# EAGLE schematic de0 (EAGLE 9.6.2)
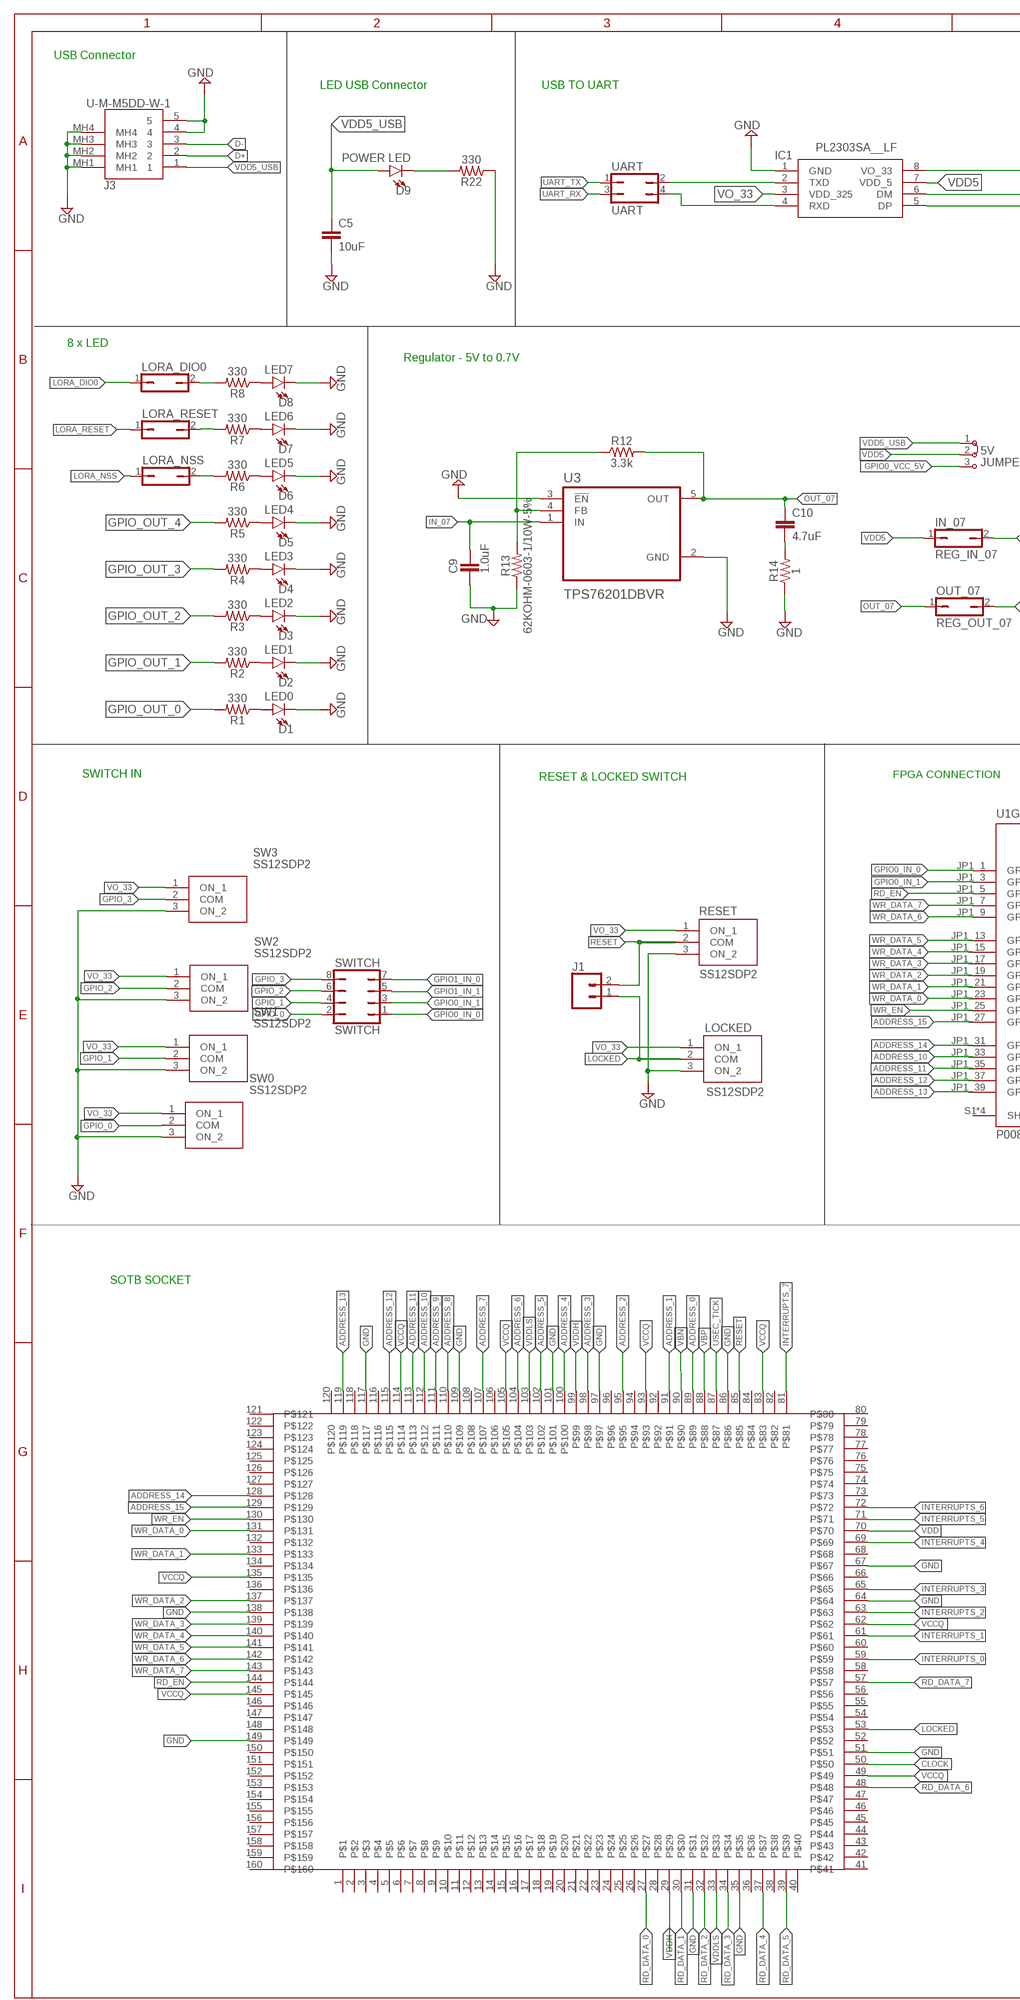
[diagram p0: schematic, sheet 1, part 1 of 2]
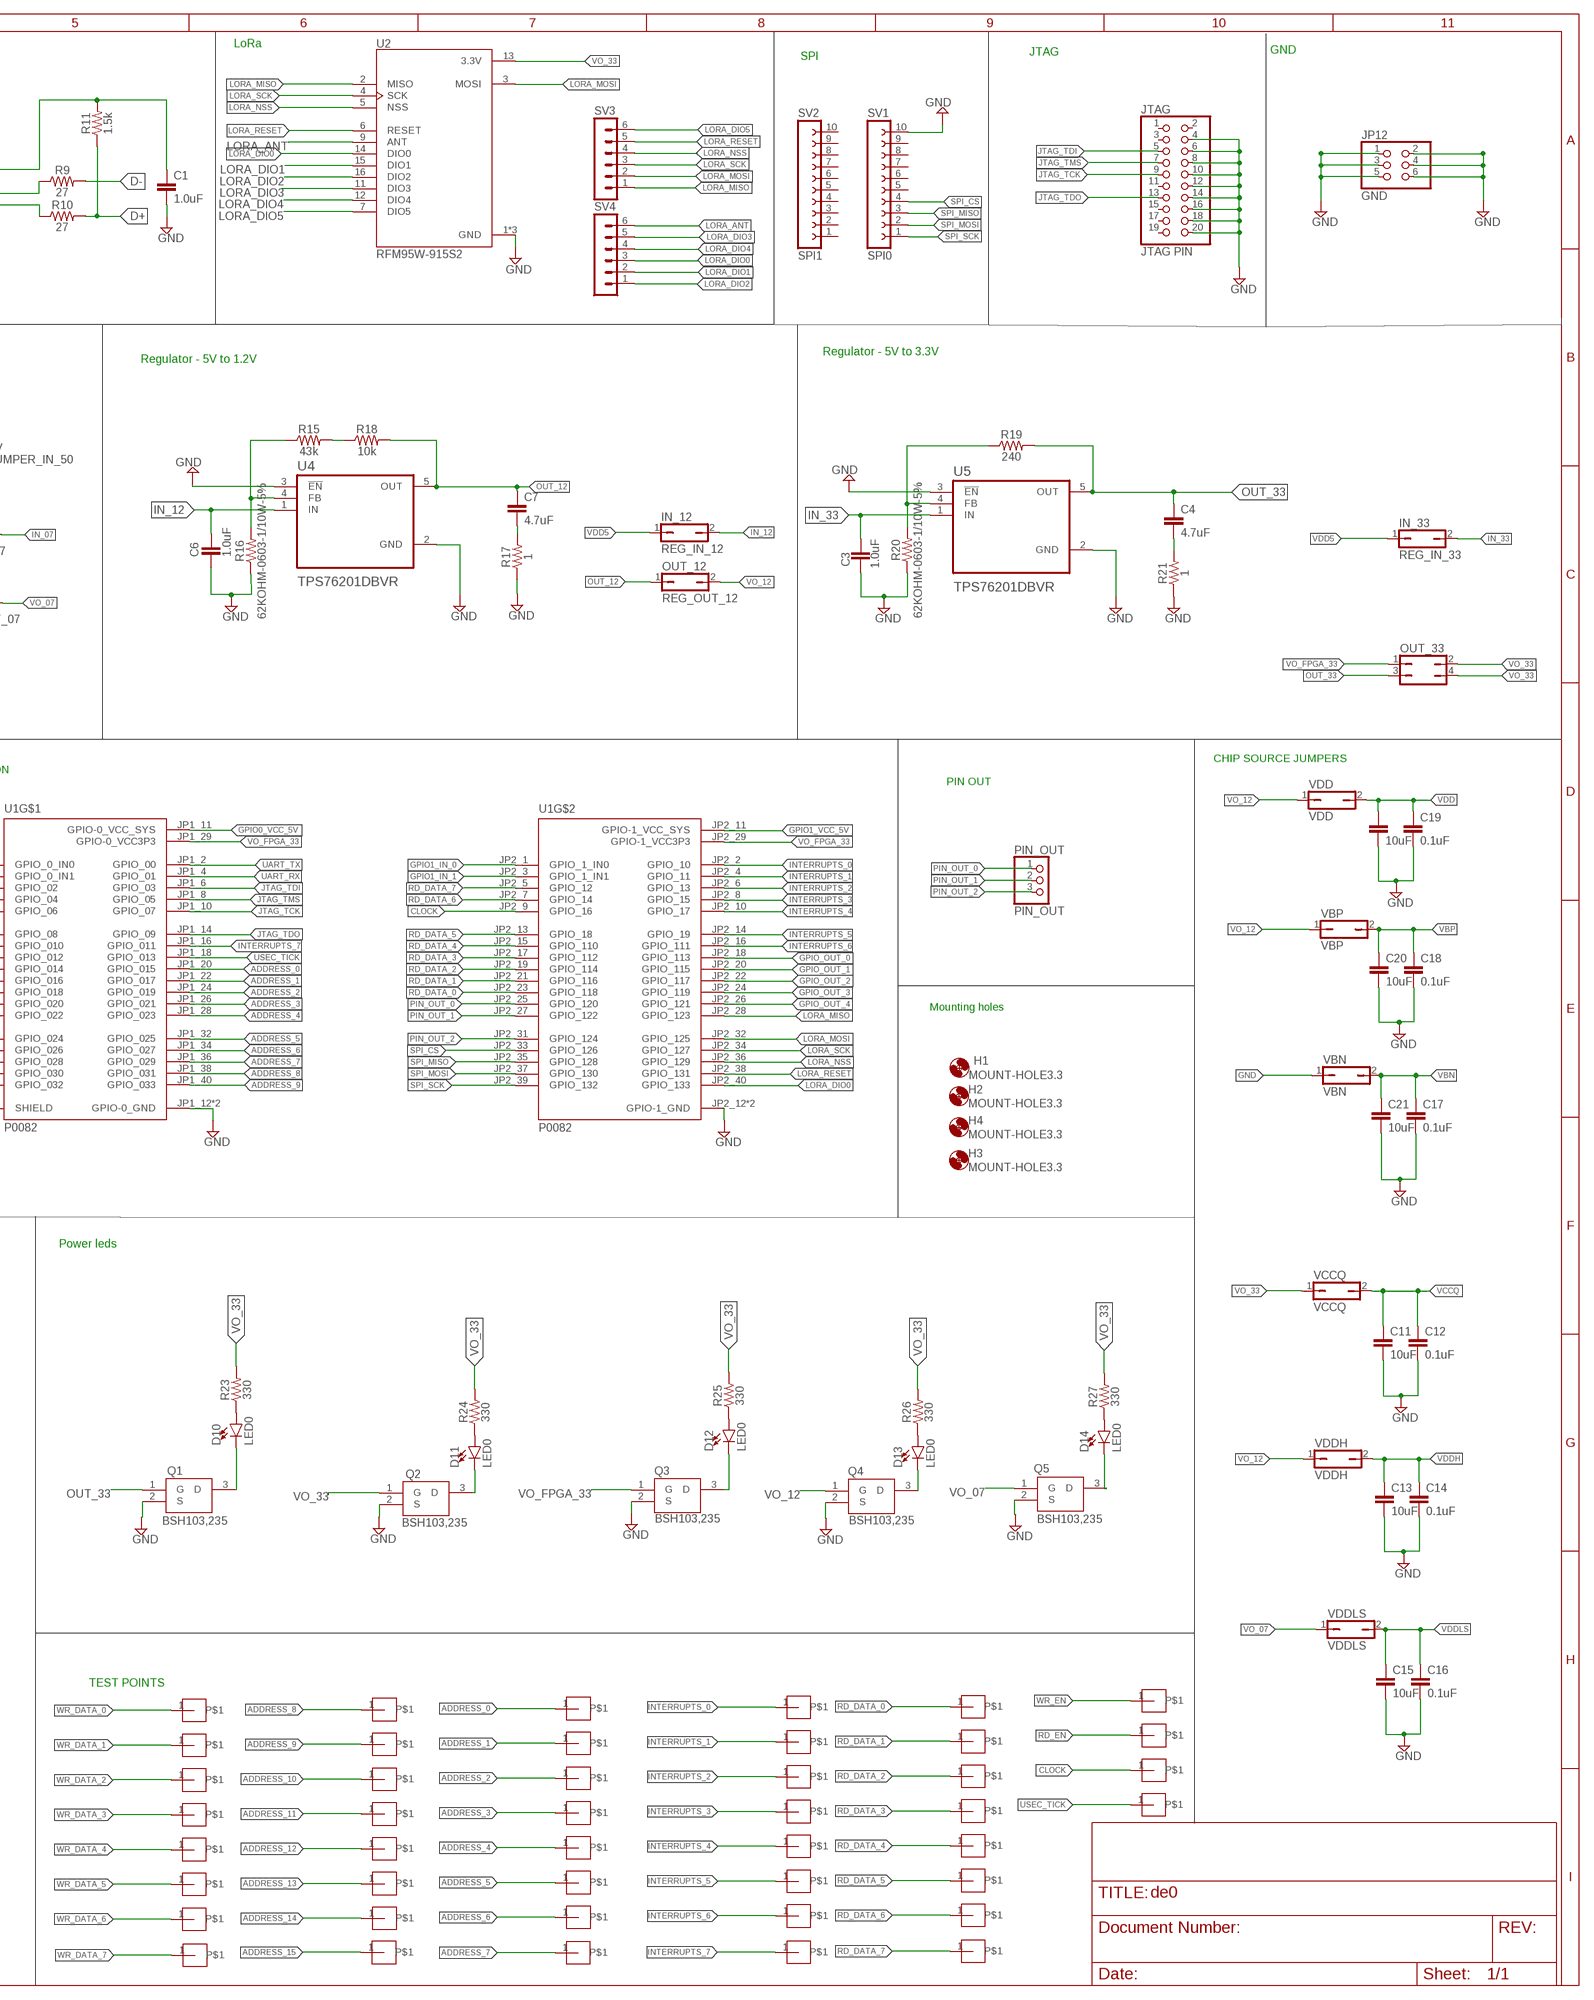
[diagram p1: schematic, sheet 1, part 2 of 2]

## Parts
5V  JUMPER_IN_50  J2X2MM  [04C]
ADDRESS_0  POINT  [POINT]
ADDRESS_1  POINT  [POINT]
ADDRESS_2  POINT  [POINT]
ADDRESS_3  POINT  [POINT]
ADDRESS_4  POINT  [POINT]
ADDRESS_5  POINT  [POINT]
ADDRESS_6  POINT  [POINT]
ADDRESS_7  POINT  [POINT]
ADDRESS_8  POINT  [POINT]
ADDRESS_9  POINT  [POINT]
ADDRESS_10  POINT  [POINT]
ADDRESS_11  POINT  [POINT]
ADDRESS_12  POINT  [POINT]
ADDRESS_13  POINT  [POINT]
ADDRESS_14  POINT  [POINT]
ADDRESS_15  POINT  [POINT]
C1  1.0uF  1.0UF-0603-16V-10%  [0603]
C3  1.0uF  1.0UF-0603-16V-10%  [0603]
C4  4.7uF  4.7UF0603  [0603]
C5  10uF  10UF-0603-6.3V-20%  [0603]
C6  1.0uF  1.0UF-0603-16V-10%  [0603]
C7  4.7uF  4.7UF0603  [0603]
C9  1.0uF  1.0UF-0603-16V-10%  [0603]
C10  4.7uF  4.7UF0603  [0603]
C11  10uF  10UF-0603-6.3V-20%  [0603]
C12  0.1uF  0.1UF-0603-25V-(+80/-20%)  [0603]
C13  10uF  10UF-0603-6.3V-20%  [0603]
C14  0.1uF  0.1UF-0603-25V-(+80/-20%)  [0603]
C15  10uF  10UF-0603-6.3V-20%  [0603]
C16  0.1uF  0.1UF-0603-25V-(+80/-20%)  [0603]
C17  0.1uF  0.1UF-0603-25V-(+80/-20%)  [0603]
C18  0.1uF  0.1UF-0603-25V-(+80/-20%)  [0603]
C19  0.1uF  0.1UF-0603-25V-(+80/-20%)  [0603]
C20  10uF  10UF-0603-6.3V-20%  [0603]
C21  10uF  10UF-0603-6.3V-20%  [0603]
C22  10uF  10UF-0603-6.3V-20%  [0603]
CLOCK  POINT  [POINT]
D1  LED0  LED0603  [LED-0603]
D2  LED1  LED0603  [LED-0603]
D3  LED2  LED0603  [LED-0603]
D4  LED3  LED0603  [LED-0603]
D5  LED4  LED0603  [LED-0603]
D6  LED5  LED0603  [LED-0603]
D7  LED6  LED0603  [LED-0603]
D8  LED7  LED0603  [LED-0603]
D9  POWER LED  LED0603  [LED-0603]
D10  LED0  LED0603  [LED-0603]
D11  LED0  LED0603  [LED-0603]
D12  LED0  LED0603  [LED-0603]
D13  LED0  LED0603  [LED-0603]
D14  LED0  LED0603  [LED-0603]
H1  MOUNT-HOLE3.3  [3,3]
H2  MOUNT-HOLE3.3  [3,3]
H3  MOUNT-HOLE3.3  [3,3]
H4  MOUNT-HOLE3.3  [3,3]
IC1  PL2303SA__LF  [SOIC127P600X170-8N]
IN_07  REG_IN_07  JP1Q  [JP1]
IN_12  REG_IN_12  JP1Q  [JP1]
IN_33  REG_IN_33  JP1Q  [JP1]
INTERRUPTS_6  INTERRUPTS_6  POINT  [POINT]
J1  CONN_02  [1X02]
J3  U-M-M5DD-W-1  [UMM5DDW1]
JP12  GND  PINHD-2X3  [2X03]
JTAG  JTAG PIN  PINHD-2X10  [2X10]
LOCKED  SS12SDP2  [SS12SDP2]
LORA_DIO0  JP1Q  [JP1]
LORA_NSS  JP1Q  [JP1]
LORA_RESET  JP1Q  [JP1]
OUT_07  REG_OUT_07  JP1Q  [JP1]
OUT_12  REG_OUT_12  JP1Q  [JP1]
OUT_33  JP2Q  [JP2Q]
PIN_OUT  PIN_OUT  PINHD-1X3  [1X03]
Q1  BSH103,235  [SOT95P230X110-3N]
Q2  BSH103,235  [SOT95P230X110-3N]
Q3  BSH103,235  [SOT95P230X110-3N]
Q4  BSH103,235  [SOT95P230X110-3N]
Q5  BSH103,235  [SOT95P230X110-3N]
R1  330  330OHM-0603-1/10W-1%  [0603]
R2  330  330OHM-0603-1/10W-1%  [0603]
R3  330  330OHM-0603-1/10W-1%  [0603]
R4  330  330OHM-0603-1/10W-1%  [0603]
R5  330  330OHM-0603-1/10W-1%  [0603]
R6  330  330OHM-0603-1/10W-1%  [0603]
R7  330  330OHM-0603-1/10W-1%  [0603]
R8  330  330OHM-0603-1/10W-1%  [0603]
R9  27  27OHM-0603-1/10W-1%  [0603]
R10  27  27OHM-0603-1/10W-1%  [0603]
R11  1.5k  1.5KOHM-0603-1/10W-1%  [0603]
R12  3.3k  3.3KOHM-0603-1/10W-1%  [0603]
R13  62KOHM-0603-1/10W-5%  [0603]
R14  1  1OHM-0603-1/10W-1%  [0603]
R15  43k  43KOHM-0603-1/10W-1%  [0603]
R16  62KOHM-0603-1/10W-5%  [0603]
R17  1  1OHM-0603-1/10W-1%  [0603]
R18  10k  10KOHM-0603-1/10W-1%  [0603]
R19  240  240OHM-0603-1/10W-1%  [0603]
R20  62KOHM-0603-1/10W-5%  [0603]
R21  1  1OHM-0603-1/10W-1%  [0603]
R22  330  330OHM-0603-1/10W-1%  [0603]
R23  330  330OHM-0603-1/10W-1%  [0603]
R24  330  330OHM-0603-1/10W-1%  [0603]
R25  330  330OHM-0603-1/10W-1%  [0603]
R26  330  330OHM-0603-1/10W-1%  [0603]
R27  330  330OHM-0603-1/10W-1%  [0603]
RD_DATA_0  POINT  [POINT]
RD_DATA_2  POINT  [POINT]
RD_DATA_3  POINT  [POINT]
RD_DATA_4  POINT  [POINT]
RD_DATA_5  POINT  [POINT]
RD_DATA_6  POINT  [POINT]
RD_DATA_7  POINT  [POINT]
RD_EN  POINT  [POINT]
RESET  SS12SDP2  [SS12SDP2]
SV1  SPI0  FE10-1  [FE10]
SV2  SPI1  FE10-1  [FE10]
SV3  MA06-1  [MA06-1]
SV4  MA06-1  [MA06-1]
SW0  SS12SDP2  [SS12SDP2]
SW1  SS12SDP2  [SS12SDP2]
SW2  SS12SDP2  [SS12SDP2]
SW3  SS12SDP2  [SS12SDP2]
SWITCH  SWITCH  JP4Q  [JP4Q]
U1  P0082  [MODULE_P0082_BOTTOMMOUNT]
U2  RFM95W-915S2  [XCVR_RFM95W-915S2]
U3  TPS76201DBVR  [SOT95P280X145-5N]
U4  TPS76201DBVR  [SOT95P280X145-5N]
U5  TPS76201DBVR  [SOT95P280X145-5N]
U$1  SOCKET  QFP160_SOCKET  [QFP160_SOCKET]
U$4  POINT  [POINT]
U$10  INTERRUPTS_0  POINT  [POINT]
U$11  INTERRUPTS_1  POINT  [POINT]
U$12  INTERRUPTS_2  POINT  [POINT]
U$13  INTERRUPTS_3  POINT  [POINT]
U$14  INTERRUPTS_5  POINT  [POINT]
U$15  INTERRUPTS_5  POINT  [POINT]
U$17  INTERRUPTS_7  POINT  [POINT]
U$40  POINT  [POINT]
UART  UART  JP2Q  [JP2Q]
USEC_TICK  POINT  [POINT]
VBN  VBN  JP1Q  [JP1]
VBP  VBP  JP1Q  [JP1]
VCCQ  VCCQ  JP1Q  [JP1]
VDD  VDD  JP1Q  [JP1]
VDDH  VDDH  JP1Q  [JP1]
VDDLS  VDDLS  JP1Q  [JP1]
WR_DATA_0  POINT  [POINT]
WR_DATA_1  POINT  [POINT]
WR_DATA_2  POINT  [POINT]
WR_DATA_3  POINT  [POINT]
WR_DATA_4  POINT  [POINT]
WR_DATA_5  POINT  [POINT]
WR_DATA_7  POINT  [POINT]
WR_EN  POINT  [POINT]

## Nets
ADDRESS_0: ADDRESS_0.1 U1.JP1_20(GPIO_015) U$1.89
ADDRESS_1: ADDRESS_1.1 U1.JP1_22(GPIO_017) U$1.91
ADDRESS_2: ADDRESS_2.1 U1.JP1_24(GPIO_019) U$1.95
ADDRESS_3: ADDRESS_3.1 U1.JP1_26(GPIO_021) U$1.98
ADDRESS_4: ADDRESS_4.1 U1.JP1_28(GPIO_023) U$1.100
ADDRESS_5: ADDRESS_5.1 U1.JP1_32(GPIO_025) U$1.102
ADDRESS_6: ADDRESS_6.1 U1.JP1_34(GPIO_027) U$1.104
ADDRESS_7: ADDRESS_7.1 U1.JP1_36(GPIO_029) U$1.107
ADDRESS_8: ADDRESS_8.1 U1.JP1_38(GPIO_031) U$1.110
ADDRESS_9: ADDRESS_9.1 U1.JP1_40(GPIO_033) U$1.111
ADDRESS_10: ADDRESS_10.1 U1.JP1_33(GPIO_026) U$1.112
ADDRESS_11: ADDRESS_11.1 U1.JP1_35(GPIO_028) U$1.113
ADDRESS_12: ADDRESS_12.1 U1.JP1_37(GPIO_030) U$1.115
ADDRESS_13: ADDRESS_13.1 U1.JP1_39(GPIO_032) U$1.119
ADDRESS_14: ADDRESS_14.1 U1.JP1_31(GPIO_024) U$1.128
ADDRESS_15: ADDRESS_15.1 U1.JP1_27(GPIO_022) U$1.129
CLOCK: CLOCK.1 U1.JP2_9(GPIO_16) U$1.50
D+: J3.2 R10.2 R11.1
D-: J3.3 R9.2
GND: C1.2 C3.2 C5.2 C6.2 C9.2 C11.2 C12.2 C13.2 C14.2 C15.2 C16.2 C17.2 C18.2 C19.2 C20.2 C21.2 C22.2 D1.C D2.C D3.C D4.C D5.C D6.C D7.C D8.C IC1.1(GND) J3.4 J3.5 J3.MH1 J3.MH2 J3.MH3 J3.MH4 JP12.1 JP12.2 JP12.3 JP12.4 JP12.5 JP12.6 JTAG.4 JTAG.6 JTAG.8 JTAG.10 JTAG.12 JTAG.14 JTAG.16 JTAG.18 JTAG.20 LOCKED.3(ON_2) Q1.2(S) Q2.2(S) Q3.2(S) Q4.2(S) Q5.2(S) R13.1 R14.1 R16.1 R17.1 R20.1 R21.1 R22.1 RESET.3(ON_2) SV1.10 SW0.3(ON_2) SW1.3(ON_2) SW2.3(ON_2) SW3.3(ON_2) U1.JP1_12(GPIO-0_GND) U1.JP1_30(GPIO-0_GND) U1.JP2_12(GPIO-1_GND) U1.JP2_30(GPIO-1_GND) U2.1(GND) U2.8(GND) U2.10(GND) U3.2(GND) U3.3(!EN) U4.2(GND) U4.3(!EN) U5.2(GND) U5.3(!EN) U$1.31 U$1.35 U$1.51 U$1.64 U$1.67 U$1.86 U$1.97 U$1.101 U$1.109 U$1.117 U$1.138 U$1.149 VBN.1
GPIO0_IN_0: SWITCH.1 U1.JP1_1(GPIO_0_IN0)
GPIO0_IN_1: SWITCH.3 U1.JP1_3(GPIO_0_IN1)
GPIO0_VCC_5V: 5V.3 U1.JP1_11(GPIO-0_VCC_SYS)
GPIO1_IN_0: SWITCH.7 U1.JP2_1(GPIO_1_IN0)
GPIO1_IN_1: SWITCH.5 U1.JP2_3(GPIO_1_IN1)
GPIO1_VCC_5V: U1.JP2_11(GPIO-1_VCC_SYS)
GPIO_0: SW0.2(COM) SWITCH.2
GPIO_1: SW1.2(COM) SWITCH.4
GPIO_2: SW2.2(COM) SWITCH.6
GPIO_3: SW3.2(COM) SWITCH.8
GPIO_OUT_0: R1.2 U1.JP2_18(GPIO_113)
GPIO_OUT_1: R2.2 U1.JP2_20(GPIO_115)
GPIO_OUT_2: R3.2 U1.JP2_22(GPIO_117)
GPIO_OUT_3: R4.2 U1.JP2_24(GPIO_119)
GPIO_OUT_4: R5.2 U1.JP2_26(GPIO_121)
IN_07: C9.1 IN_07.2 U3.1(IN)
IN_12: C6.1 IN_12.2 U4.1(IN)
IN_33: C3.1 IN_33.2 U5.1(IN)
INTERRUPTS_0: U1.JP2_2(GPIO_10) U$1.59 U$10.1
INTERRUPTS_1: U1.JP2_4(GPIO_11) U$1.61 U$11.1
INTERRUPTS_2: U1.JP2_6(GPIO_13) U$1.63 U$12.1
INTERRUPTS_3: U1.JP2_8(GPIO_15) U$1.65 U$13.1
INTERRUPTS_4: U1.JP2_10(GPIO_17) U$1.69 U$14.1
INTERRUPTS_5: U1.JP2_14(GPIO_19) U$1.71 U$15.1
INTERRUPTS_6: INTERRUPTS_6.1 U1.JP2_16(GPIO_111) U$1.72
INTERRUPTS_7: U1.JP1_16(GPIO_011) U$1.81 U$17.1
JTAG_TCK: JTAG.9 U1.JP1_10(GPIO_07)
JTAG_TDI: JTAG.5 U1.JP1_6(GPIO_03)
JTAG_TDO: JTAG.13 U1.JP1_14(GPIO_09)
JTAG_TMS: JTAG.7 U1.JP1_8(GPIO_05)
LOCKED: J1.1 LOCKED.2(COM) U$1.53
LORA_ANT: SV4.6 U2.9(ANT)
LORA_DIO0: LORA_DIO0.1 SV4.3 U1.JP2_40(GPIO_133) U2.14(DIO0)
LORA_DIO1: SV4.2 U2.15(DIO1)
LORA_DIO2: SV4.1 U2.16(DIO2)
LORA_DIO3: SV4.5 U2.11(DIO3)
LORA_DIO4: SV4.4 U2.12(DIO4)
LORA_DIO5: SV3.6 U2.7(DIO5)
LORA_MISO: SV3.1 U1.JP2_28(GPIO_123) U2.2(MISO)
LORA_MOSI: SV3.2 U1.JP2_32(GPIO_125) U2.3(MOSI)
LORA_NSS: LORA_NSS.1 SV3.4 U1.JP2_36(GPIO_129) U2.5(NSS)
LORA_RESET: LORA_RESET.1 SV3.5 U1.JP2_38(GPIO_131) U2.6(RESET)
LORA_SCK: SV3.3 U1.JP2_34(GPIO_127) U2.4(SCK)
N$1: D1.A R1.1
N$2: D8.A R8.1
N$3: D7.A R7.1
N$4: D6.A R6.1
N$5: D5.A R5.1
N$6: D4.A R4.1
N$7: D2.A R2.1
N$8: D3.A R3.1
N$9: D10.A R23.1
N$10: D10.C Q1.3(D)
N$11: D12.A R25.1
N$12: D12.C Q3.3(D)
N$13: D11.A R24.1
N$14: D11.C Q2.3(D)
N$15: D13.A R26.1
N$16: D13.C Q4.3(D)
N$17: IC1.6(DM) R9.1
N$18: D14.A R27.1
N$19: D14.C Q5.3(D)
N$20: IC1.5(DP) R10.1
N$21: IC1.2(TXD) UART.2
N$22: IC1.4(RXD) UART.4
N$23: LORA_DIO0.2 R8.2
N$24: LORA_RESET.2 R7.2
N$25: LORA_NSS.2 R6.2
N$29: R12.1 R13.2 U3.4(FB)
N$30: R15.1 R16.2 U4.4(FB)
N$31: C10.2 R14.2
N$32: C7.2 R17.2
N$33: R15.2 R18.1
N$34: R19.1 R20.2 U5.4(FB)
N$35: C4.2 R21.2
N$36: D9.C R22.2
OUT_07: C10.1 OUT_07.1 R12.2 U3.5(OUT)
OUT_12: C7.1 OUT_12.1 R18.2 U4.5(OUT)
OUT_33: C4.1 OUT_33.3 Q1.1(G) R19.2 U5.5(OUT)
PIN_OUT_0: PIN_OUT.1 U1.JP2_25(GPIO_120)
PIN_OUT_1: PIN_OUT.2 U1.JP2_27(GPIO_122)
PIN_OUT_2: PIN_OUT.3 U1.JP2_31(GPIO_124)
RD_DATA_0: RD_DATA_0.1 U1.JP2_23(GPIO_118) U$1.27
RD_DATA_1: U1.JP2_21(GPIO_116) U$1.30 U$4.1
RD_DATA_2: RD_DATA_2.1 U1.JP2_19(GPIO_114) U$1.32
RD_DATA_3: RD_DATA_3.1 U1.JP2_17(GPIO_112) U$1.34
RD_DATA_4: RD_DATA_4.1 U1.JP2_15(GPIO_110) U$1.37
RD_DATA_5: RD_DATA_5.1 U1.JP2_13(GPIO_18) U$1.39
RD_DATA_6: RD_DATA_6.1 U1.JP2_7(GPIO_14) U$1.48
RD_DATA_7: RD_DATA_7.1 U1.JP2_5(GPIO_12) U$1.57
RD_EN: RD_EN.1 U1.JP1_5(GPIO_02) U$1.144
RESET: J1.2 RESET.2(COM) U$1.85
SPI_CS: SV1.4 U1.JP2_33(GPIO_126)
SPI_MISO: SV1.3 U1.JP2_35(GPIO_128)
SPI_MOSI: SV1.2 U1.JP2_37(GPIO_130)
SPI_SCK: SV1.1 U1.JP2_39(GPIO_132)
UART_RX: U1.JP1_4(GPIO_01) UART.3
UART_TX: U1.JP1_2(GPIO_00) UART.1
USEC_TICK: U1.JP1_18(GPIO_013) U$1.87 USEC_TICK.1
VBN: C17.1 C21.1 U$1.90 VBN.2
VBP: C18.1 C20.1 U$1.88 VBP.2
VCCQ: C11.1 C12.1 U$1.49 U$1.62 U$1.83 U$1.93 U$1.105 U$1.114 U$1.135 U$1.145 VCCQ.2
VDD: C19.1 C22.1 U$1.70 VDD.2
VDD5: 5V.2 IC1.7(VDD_5) IN_07.1 IN_12.1 IN_33.1
VDD5_USB: 5V.1 C5.1 D9.A J3.1
VDDH: C13.1 C14.1 U$1.29 U$1.99 VDDH.2
VDDLS: C15.1 C16.1 U$1.33 U$1.103 VDDLS.2
VO_07: OUT_07.2 Q5.1(G) VDDLS.1
VO_12: OUT_12.2 Q4.1(G) VBP.1 VDD.1 VDDH.1
VO_33: C1.1 IC1.3(VDD_325) IC1.8(VO_33) LOCKED.1(ON_1) OUT_33.2 OUT_33.4 Q2.1(G) R11.2 R23.2 R24.2 R25.2 R26.2 R27.2 RESET.1(ON_1) SW0.1(ON_1) SW1.1(ON_1) SW2.1(ON_1) SW3.1(ON_1) U2.13(3.3V) VCCQ.1
VO_FPGA_33: OUT_33.1 Q3.1(G) U1.JP1_29(GPIO-0_VCC3P3) U1.JP2_29(GPIO-1_VCC3P3)
WR_DATA_0: U1.JP1_23(GPIO_018) U$1.131 WR_DATA_0.1
WR_DATA_1: U1.JP1_21(GPIO_016) U$1.133 WR_DATA_1.1
WR_DATA_2: U1.JP1_19(GPIO_014) U$1.137 WR_DATA_2.1
WR_DATA_3: U1.JP1_17(GPIO_012) U$1.139 WR_DATA_3.1
WR_DATA_4: U1.JP1_15(GPIO_010) U$1.140 WR_DATA_4.1
WR_DATA_5: U1.JP1_13(GPIO_08) U$1.141 WR_DATA_5.1
WR_DATA_6: U1.JP1_9(GPIO_06) U$1.142 U$40.1
WR_DATA_7: U1.JP1_7(GPIO_04) U$1.143 WR_DATA_7.1
WR_EN: U1.JP1_25(GPIO_020) U$1.130 WR_EN.1
Unconnected: JTAG.1 JTAG.2 JTAG.3 JTAG.11 JTAG.15 JTAG.17 JTAG.19 SV1.5 SV1.6 SV1.7 SV1.8 SV1.9 SV2.1 SV2.2 SV2.3 SV2.4 SV2.5 SV2.6 SV2.7 SV2.8 SV2.9 SV2.10 U1.S1(SHIELD) U1.S2(SHIELD) U1.S3(SHIELD) U1.S4(SHIELD) U$1.1 U$1.2 U$1.3 U$1.4 U$1.5 U$1.6 U$1.7 U$1.8 U$1.9 U$1.10 U$1.11 U$1.12 U$1.13 U$1.14 U$1.15 U$1.16 U$1.17 U$1.18 U$1.19 U$1.20 U$1.21 U$1.22 U$1.23 U$1.24 U$1.25 U$1.26 U$1.28 U$1.36 U$1.38 U$1.40 U$1.41 U$1.42 U$1.43 U$1.44 U$1.45 U$1.46 U$1.47 U$1.52 U$1.54 U$1.55 U$1.56 U$1.58 U$1.60 U$1.66 U$1.68 U$1.73 U$1.74 U$1.75 U$1.76 U$1.77 U$1.78 U$1.79 U$1.80 U$1.82 U$1.84 U$1.92 U$1.94 U$1.96 U$1.106 U$1.108 U$1.116 U$1.118 U$1.120 U$1.121 U$1.122 U$1.123 U$1.124 U$1.125 U$1.126 U$1.127 U$1.132 U$1.134 U$1.136 U$1.146 U$1.147 U$1.148 U$1.150 U$1.151 U$1.152 U$1.153 U$1.154 U$1.155 U$1.156 U$1.157 U$1.158 U$1.159 U$1.160

## Notes on the sheet
- LoRa
- JTAG | GND
- USB Connector | SPI
- LED USB Connector | USB TO UART
- 8 x LED
- Regulator - 5V to 3.3V
- Regulator - 5V to 0.7V
- Regulator - 5V to 1.2V
- CHIP SOURCE JUMPERS
- SWITCH IN | RESET & LOCKED SWITCH | FPGA CONNECTION
- PIN OUT
- Mounting holes
- Power leds
- SOTB SOCKET
- TEST POINTS

## Library data of the parts
5V = jumper:J2: Jumper switch 2 x 2.5 mm
ADDRESS_0 ADDRESS_1-ADDRESS_15 CLOCK INTERRUPTS_6 RD_DATA_0 RD_DATA_2-RD_DATA_7 RD_EN U$4 U$10-U$15 U$17 U$40 USEC_TICK WR_DATA_0 WR_DATA_1-WR_DATA_5 WR_DATA_7 WR_EN = qfp160:POINT
C1 C3 C6 C9 = SparkFun-Capacitors:1.0UF: 1µF ceramic capacitors A capacitor is a passive two-terminal electrical component used to store electrical energy temporarily in an electric field.; PROD_ID: CAP-00868
C4 C7 C10 = SparkFun-Capacitors:4.7UF: 4.7µF ceramic capacitors A capacitor is a passive two-terminal electrical component used to store electrical energy temporarily in an electric field.; PROD_ID: CAP-08280
C5 C11 C13 C15 C20-C22 = SparkFun-Capacitors:10UF: 10.0µF ceramic capacitors A capacitor is a passive two-terminal electrical component used to store electrical energy temporarily in an electric field.; PROD_ID: CAP-11015
C12 C14 C16-C19 = SparkFun-Capacitors:0.1UF: 0.1µF ceramic capacitors A capacitor is a passive two-terminal electrical component used to store electrical energy temporarily in an electric field.; PROD_ID: CAP-00810
D1-D14 = SparkFun-LED:LED: LED (Generic) Standard schematic elements and footprints for 5mm, 3mm, 1206, and 0603 sized LEDs. Generic LEDs with no color specified.
H1-H4 = holes:MOUNT-HOLE: MOUNTING HOLE with drill center marker
IC1 = PL2303SA__LF:PL2303SA__LF: SOP-8_150mil USB ICs Source: Datasheet <https://datasheet.lcsc.com/szlcsc/1809200034_Prolific-Tech-PL2303SA-LF_C57946.pdf>; DESCRIPTION: SOP-8_150mil USB ICs; HEIGHT: 1.7mm; MANUFACTURER_NAME: Prolific Tech; MANUFACTURER_PART_NUMBER: PL2303SA LF
IN_07 IN_12 IN_33 LORA_DIO0 LORA_NSS LORA_RESET OUT_07 OUT_12 VBN VBP VCCQ VDD VDDH VDDLS = jumper:JP1Q: JUMPER
J1 = SparkFun-Connectors:CONN_02: Multi connection point. Often used as Generic Header-pin footprint for 0.1 inch spaced/style header connections On any of the 0.1 inch spaced packages, you can populate with these: Break Away Headers - Straight <https://www.sparkfun.com/products/116> (PRT-00116) Break Away Male Headers - Right Angle <https://www.sparkfun.com/products/553> (PRT-00553) Female Headers <https://www.sparkfun.com/products/115> (PRT-00115) Break Away Headers - Machine Pin <https://www.sparkfun.com/products/117> (PRT-00117) Break Away Female Headers - Swiss Machine Pin <https://www.sparkfun.com/products/743> (PRT-00743) For SCREWTERMINALS and SPRING TERMINALS visit here: Screw Terimnals on SparkFun.com <https://www.sparkfun.com/search/results?term=Screw+Terminals> (5mm/3.5mm/2.54mm spacing) This device is also useful as a general connection point to wire up your design to another part of your project. Our various solder wires solder well into these plated through hole pads. Hook-Up Wire - Assortment (Stranded, 22 AWG) <https://www.sparkfun.com/products/11375> (PRT-11375) Hook-Up Wire - Assortment (Solid Core, 22 AWG) <https://www.sparkfun.com/products/11367> (PRT-11367) View the entire wire category on our website here <https://www.sparkfun.com/categories/141> Special notes: Molex polarized connector foot print use with: PRT-08233 with associated crimp pins and housings. 2.54_SCREWTERM for use with PRT-10571. 3.5mm Screw Terminal footprints for PRT-08084 5mm Screw Terminal footprints for use with PRT-08432
J3 = SamacSys_Parts:U-M-M5DD-W-1: USB Connectors 5 Receptacle 1 SMD RoHS Source: Datasheet <https://datasheet.lcsc.com/szlcsc/1903211731_Korean-Hroparts-Elec-U-M-M5DD-W-1_C145778.pdf>; DESCRIPTION: USB Connectors 5 Receptacle 1 SMD RoHS; HEIGHT: 3.9mm; MANUFACTURER_NAME: Korean Hroparts Elec; MANUFACTURER_PART_NUMBER: U-M-M5DD-W-1
JP12 = pinhead:PINHD-2X3: PIN HEADER
JTAG = pinhead:PINHD-2X10: PIN HEADER
LOCKED RESET SW0 SW1-SW3 = SamacSys_Parts:SS12SDP2: Switch, Slide,Sub Miniature,Top Actuated,SPDT, On-none-On Source: Datasheet; DESCRIPTION: Switch, Slide,Sub Miniature,Top Actuated,SPDT, On-none-On; HEIGHT: 4mm; MANUFACTURER_NAME: NKK Switches; MANUFACTURER_PART_NUMBER: SS12SDP2; MOUSER_PART_NUMBER: 633-SS12SDP2; MOUSER_PRICE-STOCK: https://www.mouser.co.uk/ProductDetail/NKK-Switches/SS12SDP2?qs=Av7JdS0MGqKsG%252BWOKKtU2w%3D%3D
OUT_33 UART = jumper:JP2Q: JUMPER
PIN_OUT = pinhead:PINHD-1X3: PIN HEADER
Q1-Q5 = SamacSys_Parts:BSH103,235: MOSFET TAPE13 MOSFET Source: Datasheet <http://www.nxp.com/documents/data_sheet/BSH103.pdf>; DESCRIPTION: MOSFET TAPE13 MOSFET; HEIGHT: 1.1mm; MANUFACTURER_NAME: Nexperia; MANUFACTURER_PART_NUMBER: BSH103,235; MOUSER_PART_NUMBER: 771-BSH103235; MOUSER_PRICE-STOCK: https://www.mouser.co.uk/ProductDetail/Nexperia/BSH103235?qs=me8TqzrmIYVhbJIwsR7ziw%3D%3D
R1-R8 R22-R27 = SparkFun-Resistors:330OHM: 330Ω resistor A resistor is a passive two-terminal electrical component that implements electrical resistance as a circuit element. Resistors act to reduce current flow, and, at the same time, act to lower voltage levels within circuits. - Wikipedia; PROD_ID: RES-00818
R9 R10 = SparkFun-Resistors:27OHM: 27Ω resistor A resistor is a passive two-terminal electrical component that implements electrical resistance as a circuit element. Resistors act to reduce current flow, and, at the same time, act to lower voltage levels within circuits. - Wikipedia; PROD_ID: RES-09334
R11 = SparkFun-Resistors:1.5KOHM: 1.5kΩ resistor A resistor is a passive two-terminal electrical component that implements electrical resistance as a circuit element. Resistors act to reduce current flow, and, at the same time, act to lower voltage levels within circuits. - Wikipedia; PROD_ID: RES-08306
R12 = SparkFun-Resistors:3.3KOHM: 3.3kΩ resistor A resistor is a passive two-terminal electrical component that implements electrical resistance as a circuit element. Resistors act to reduce current flow, and, at the same time, act to lower voltage levels within circuits. - Wikipedia; PROD_ID: RES-07851
R13 R16 R20 = SparkFun-Resistors:62KOHM: 62kΩ resistor A resistor is a passive two-terminal electrical component that implements electrical resistance as a circuit element. Resistors act to reduce current flow, and, at the same time, act to lower voltage levels within circuits. - Wikipedia
R14 R17 R21 = SparkFun-Resistors:1OHM: 1Ω resistor A resistor is a passive two-terminal electrical component that implements electrical resistance as a circuit element. Resistors act to reduce current flow, and, at the same time, act to lower voltage levels within circuits. - Wikipedia; PROD_ID: RES-08269
R15 = SparkFun-Resistors:43KOHM: 43kΩ resistor A resistor is a passive two-terminal electrical component that implements electrical resistance as a circuit element. Resistors act to reduce current flow, and, at the same time, act to lower voltage levels within circuits. - Wikipedia; PROD_ID: RES-07858
R18 = SparkFun-Resistors:10KOHM: 10kΩ resistor A resistor is a passive two-terminal electrical component that implements electrical resistance as a circuit element. Resistors act to reduce current flow, and, at the same time, act to lower voltage levels within circuits. - Wikipedia; PROD_ID: RES-00824
R19 = SparkFun-Resistors:240OHM: 240Ω resistor A resistor is a passive two-terminal electrical component that implements electrical resistance as a circuit element. Resistors act to reduce current flow, and, at the same time, act to lower voltage levels within circuits. - Wikipedia; PROD_ID: RES-07849
SV1 SV2 = con-lsta:FE10-1: FEMALE HEADER; OC_FARNELL: unknown; OC_NEWARK: unknown
SV3 SV4 = con-lstb:MA06-1: PIN HEADER; OC_FARNELL: unknown; OC_NEWARK: unknown
SWITCH = jumper:JP4Q: JUMPER
U1 = P0082:P0082: EP4CE22F17C6N Cyclone® IV FPGA Evaluation Board Check prices <https://pricing.snapeda.com/parts/P0082/Terasic%20Inc./view-part?ref=eda>; DESCRIPTION: EP4CE22F17C6N Cyclone® IV FPGA Evaluation Board; MF: Terasic Inc.; MP: P0082; PACKAGE: None; PRICE: None
U2 = RFM95W-915S2:RFM95W-915S2: RFM95(W) - Low Power Long Range Transceiver Module V1.0 Check prices <https://pricing.snapeda.com/parts/RFM95W-915S2/RF%20Solutions/view-part?ref=eda>; AVAILABILITY: In Stock; DESCRIPTION: General ISM < 1GHz LoRa™ Transceiver Module 915MHz Surface Mount; MF: RF Solutions; MP: RFM95W-915S2; PACKAGE: SMD-16 RF Solutions; PRICE: None
U3-U5 = TPS76201DBVR:TPS76201DBVR: Check prices <https://pricing.snapeda.com/parts/TPS76201DBVR/Texas%20Instruments/view-part?ref=eda>; AVAILABILITY: In Stock; DESCRIPTION: 100-mA, 10-V, low-IQ, adjustable low-dropout voltage regulator with enable 5-SOT-23 -40 to 125; MF: Texas Instruments; MP: TPS76201DBVR; PACKAGE: SOT-23-5 Texas Instruments; PRICE: None; PURCHASE-URL: https://pricing.snapeda.com/search/part/TPS76201DBVR/?ref=eda
U$1 = qfp160:QFP160_SOCKET